# EAGLE design konektor_zas (EAGLE 6.3)
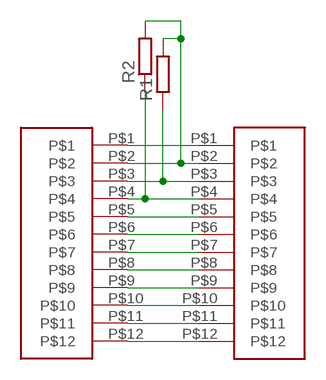
[diagram p0: schematic, sheet 1]

## Parts
R1  R-EU_R0805  [R0805]
R2  R-EU_R0805  [R0805]
U$1  12PINCON  [12PIN2MMCON]
U$2  12PINCON  [12PIN2MMCON]

## Nets
N$1: U$1.P$1 U$2.P$1
N$2: R1.2 R2.2 U$1.P$2 U$2.P$2
N$3: R1.1 U$1.P$3 U$2.P$3
N$4: R2.1 U$1.P$4 U$2.P$4
N$5: U$1.P$5 U$2.P$5
N$6: U$1.P$6 U$2.P$6
N$7: U$1.P$7 U$2.P$7
N$8: U$1.P$8 U$2.P$8
N$9: U$1.P$9 U$2.P$9
N$10: U$1.P$10 U$2.P$10
N$11: U$1.P$11 U$2.P$11
N$12: U$1.P$12 U$2.P$12

## Library data of the parts
R1 R2 = rcl:R-EU_: RESISTOR, European symbol
U$1 U$2 = ref-packages:12PINCON

## Board
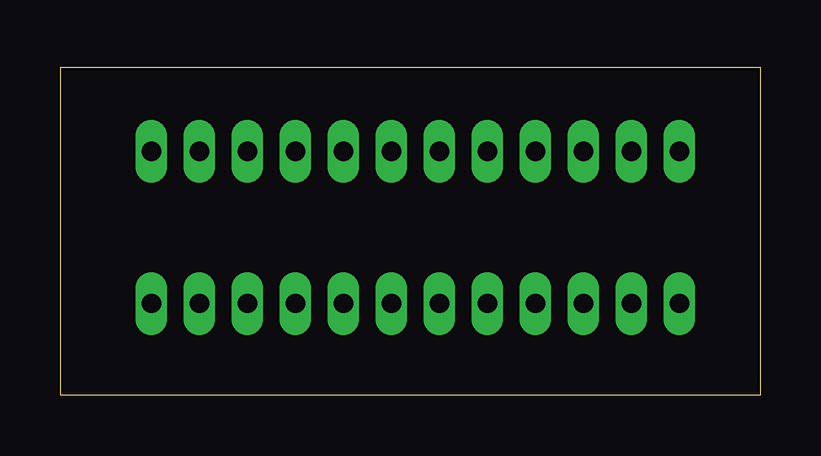
[diagram p1: board, top side]
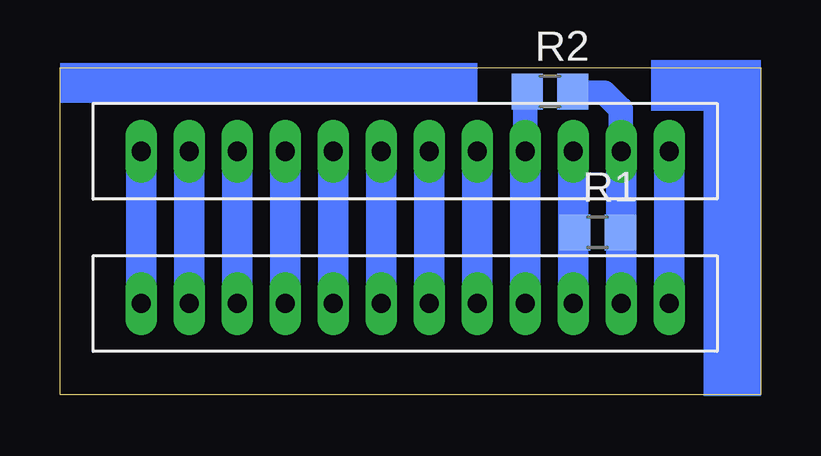
[diagram p2: board, bottom side, seen from below]

Size 29.19 x 13.64 mm. Coordinates in mm from the lower left corner, seen from the top.
Outline: 0,0 29.19,0 29.19,13.64 0,13.64 0,0
Copper layers (1*16): Top 0.035mm / dielectric 1.5mm / Bottom 0.035mm
Design rules "default": minimum track width 10mil, minimum drill 24mil, track to track 8mil, track to pad 8mil, pad to pad 8mil, via to via 8mil, smd to smd 8mil, copper to edge 40mil, drill to drill 8mil, minimum pad ring 10mil, minimum via ring 8mil, stop-mask expansion 4mil, vias tented up to drill 0mil, thermal gap 10mil

### Footprints (pad centres in the part's own frame; a part is rotated, then mirrored left to right if it is on the bottom)
R0805 = smd 1.3 x 1.5: 1 -0.95,0; 2 0.95,0
12PIN2MMCON = drill 0.8 long: P$1 0,0; P$2 2,0; P$3 4,0; P$4 6,0; P$5 8,0; P$6 10,0; P$7 12,0; P$8 14,0; P$9 16,0; P$10 18,0; P$11 20,0; P$12 22,0

### Placement (x,y rotation side)
R1  6.79,6.78 0 bottom
R2  8.77,12.65 0 bottom
U$1  3.81,10.16 0 top
U$2  3.81,3.81 0 top

### Tracks (layer width: path | path; a pad name or v marks a point on that pad's centre or on a via)
N$1
  Bottom 1.27: U$2.P$1 U$1.P$1
N$2
  Bottom 0.406: U$1.P$2 | 5.81,11.95 5.84,11.95 | 7.78,12.61 R2.2
  Bottom 1.016: U$1.P$2 5.81,11.95 | 5.84,11.95 6.51,12.61 7.78,12.61 | U$2.P$2 5.81,6.75 R1.2
  Bottom 1.27: U$2.P$2 U$1.P$2
N$3
  Bottom 1.016: U$2.P$3 7.81,6.71 R1.1
  Bottom 1.27: U$2.P$3 U$1.P$3
N$4
  Bottom 0.406: 9.81,12.56 R2.1
  Bottom 1.016: U$1.P$4 9.81,12.56
  Bottom 1.27: U$2.P$4 U$1.P$4
N$5
  Bottom 1.27: U$2.P$5 U$1.P$5
N$6
  Bottom 1.27: U$2.P$6 U$1.P$6
N$7
  Bottom 1.27: U$2.P$7 U$1.P$7
N$8
  Bottom 1.27: U$2.P$8 U$1.P$8
N$9
  Bottom 1.27: U$2.P$9 U$1.P$9
N$10
  Bottom 1.27: U$2.P$10 U$1.P$10
N$11
  Bottom 1.27: U$2.P$11 U$1.P$11
N$12
  Bottom 1.27: U$2.P$12 U$1.P$12
(copper drawn outside any net)
  shapes: Bottom area x3